# Altium schematic sheet DVC.SchDoc
size A3
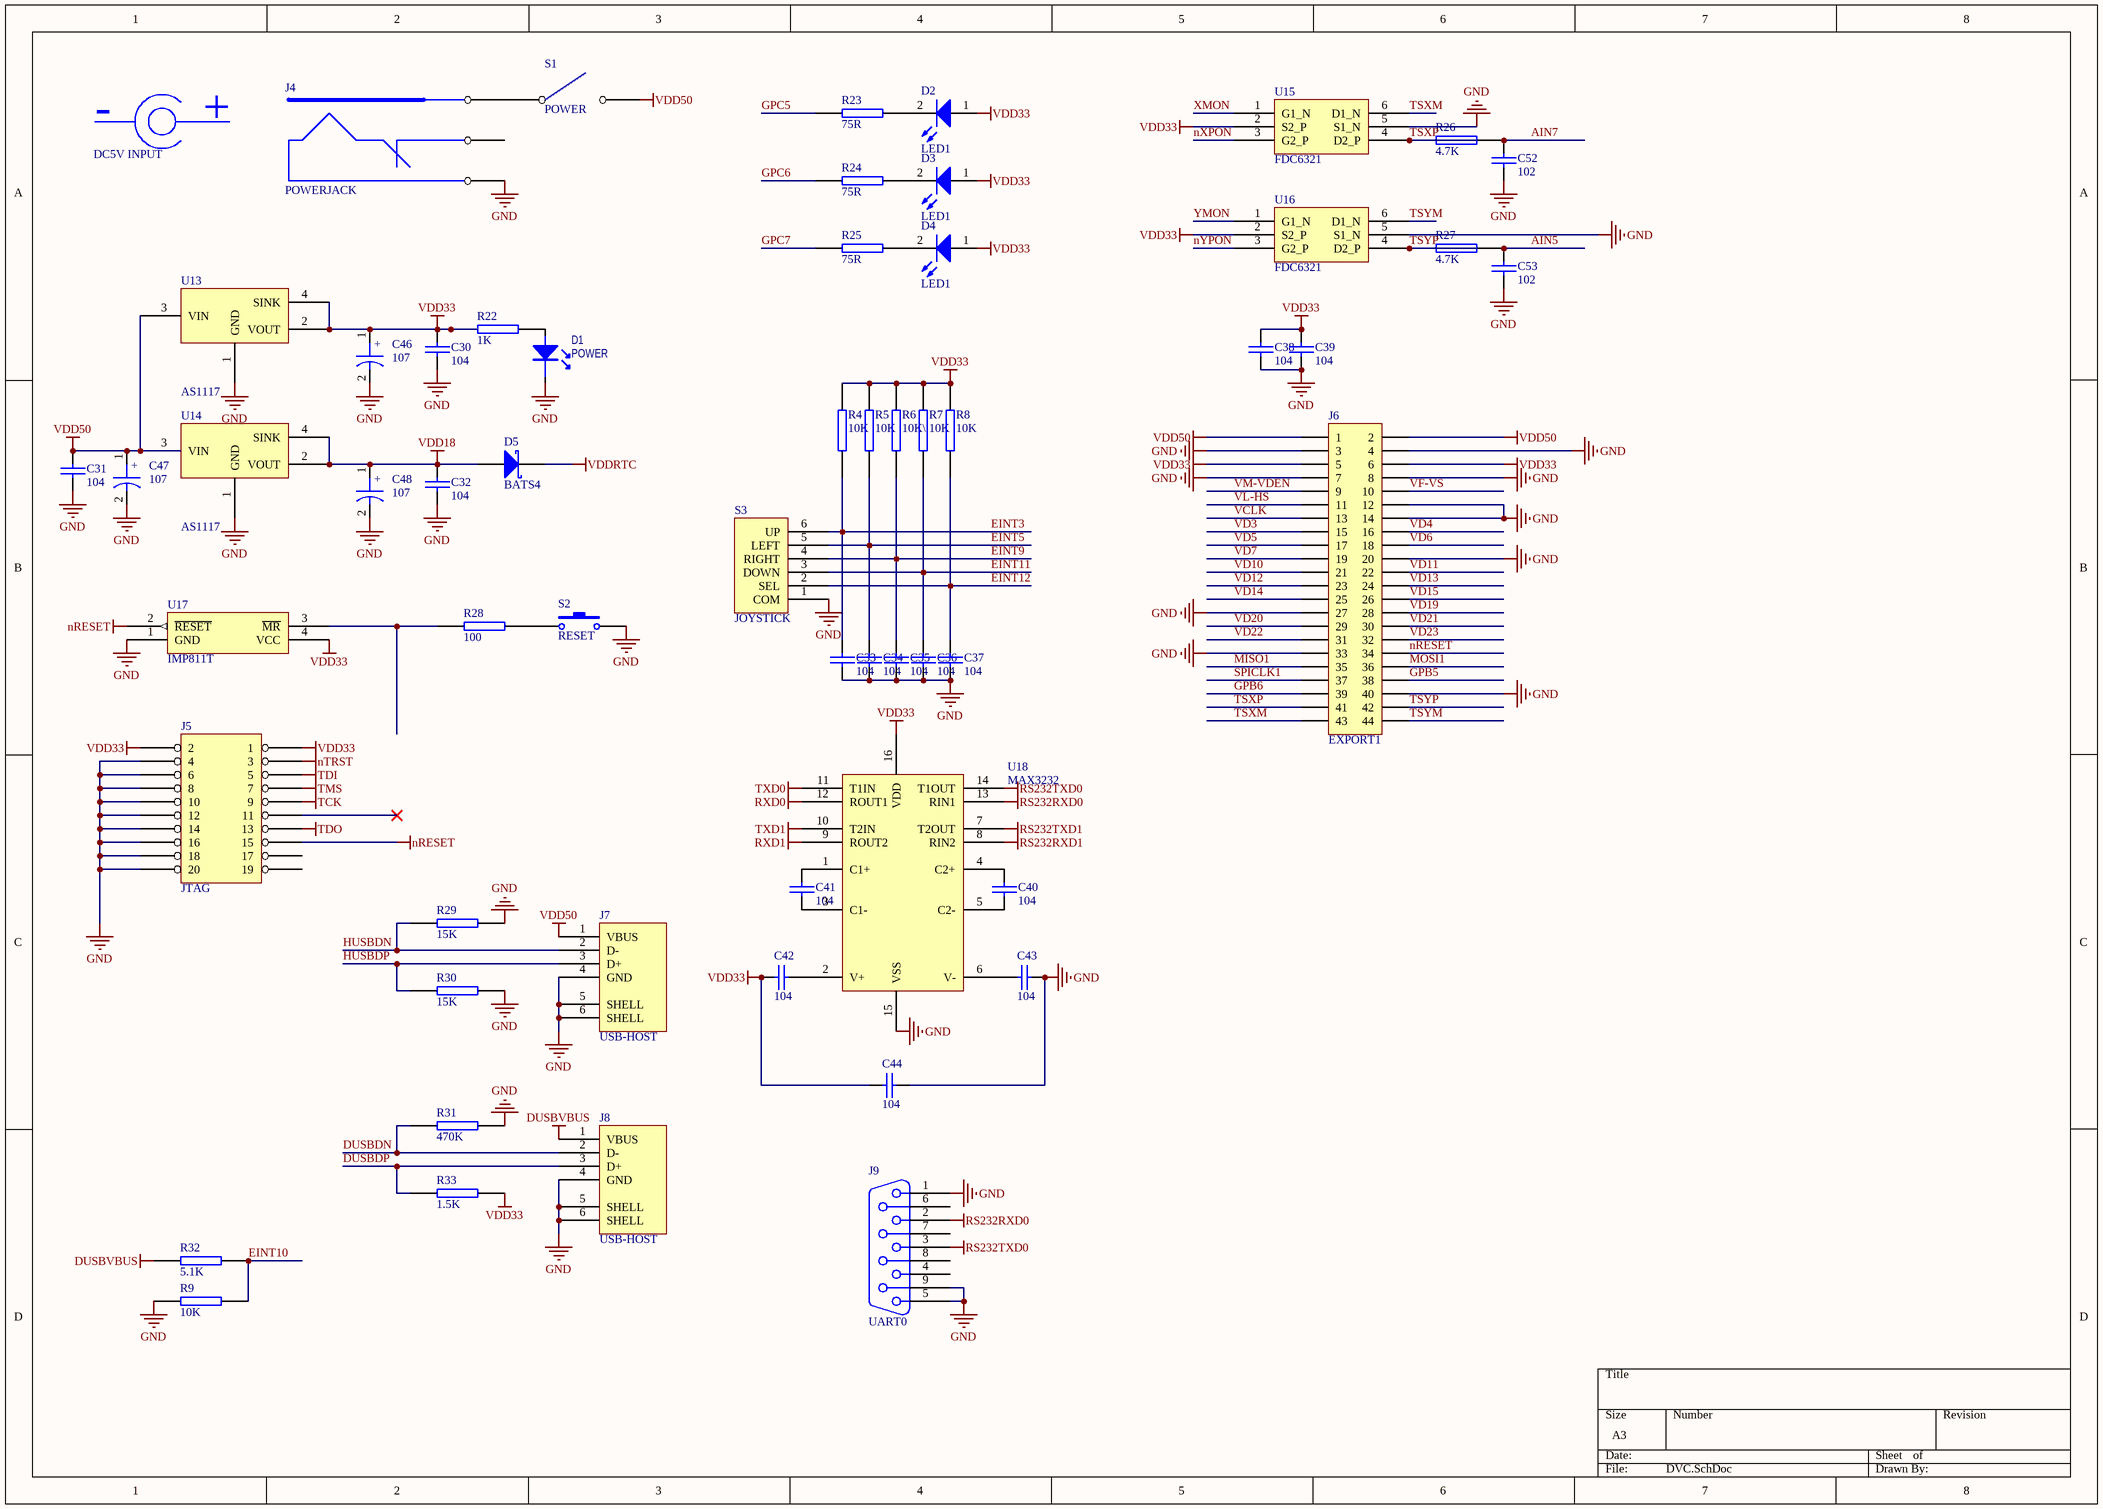
[diagram p0: DVC.SchDoc]

## Parts
?  DC5V INPUT
C30  104  [A型钽电容]
C31  104  [A型钽电容]
C32  104  [A型钽电容]
C33  104  [A型钽电容]
C34  104  [A型钽电容]
C35  104  [A型钽电容]
C36  104  [A型钽电容]
C37  104  [A型钽电容]
C38  104  [0603A]
C39  104  [0603A]
C40  104  [A型钽电容]
C41  104  [A型钽电容]
C42  104  [A型钽电容]
C43  104  [A型钽电容]
C44  104  [A型钽电容]
C46  107  [3216A]
C47  107  [3216A]
C48  107  [3216A]
C52  102  [0603A]
C53  102  [0603A]
D1  POWER  [LED]
D2  LED1  [LED0603]
D3  LED1  [LED0603]
D4  LED1  [LED0603]
D5  BATS4  [SFM-T2(3)/X1.7V]
J4  POWERJACK
J5  JTAG
J6  EXPORT1  [HDR2X22]
J7  USB-HOST
J8  USB-HOST
J9  UART0  [DB9RA/M]
R4  10K  [1206]
R5  10K  [1206]
R6  10K\  [1206]
R7  10K  [1206]
R8  10K  [1206]
R9  10K  [1206]
R22  1K  [1206]
R23  75R  [1206]
R24  75R  [1206]
R25  75R  [1206]
R26  4.7K  [1206]
R27  4.7K  [1206]
R28  100  [1206]
R29  15K  [1206]
R30  15K  [1206]
R31  470K  [1206]
R32  5.1K  [1206]
R33  1.5K  [1206]
S1  POWER
S2  RESET  [SPST-2]
S3  JOYSTICK
U13  AS1117
U14  AS1117
U15  FDC6321
U16  FDC6321
U17  IMP811T
U18  MAX3232  [SSOP16]

## Nets
DUSBVBUS: J8.1(VBUS) R32.1
GND: C30.2 C31.2 C32.2 C33.2 C34.2 C35.2 C36.2 C37.2 C38.2 C39.2 C43.1 C44.2 C46.2 C47.2 C48.2 C52.2 C53.2 D1.2 J4.3 J5.?2(4) J5.?3(6) J5.?4(8) J5.?5(10) J5.?6(12) J5.?7(14) J5.?8(16) J5.?9(18) J5.?10(20) J6.3 J6.4 J6.7 J6.8 J6.12 J6.14 J6.20 J6.27 J6.33 J6.40 J7.4(GND) J7.5(SHELL) J7.6(SHELL) J8.4(GND) J8.5(SHELL) J8.6(SHELL) J9.1 J9.5 J9.9 R9.1 R29.2 R30.2 R31.2 S2.2 S3.1(COM) U13.1(GND) U14.1(GND) U15.5(S1_N) U16.5(S1_N) U17.1(GND) U18.15(VSS)
nRESET: J5.?13(15) J6.34 U17.2(~{RESET})
nTRST: J5.?19(3)
RS232RXD0: J9.2 U18.13(RIN1)
RS232RXD1: U18.8(RIN2)
RS232TXD0: J9.3 U18.14(T1OUT)
RS232TXD1: U18.7(T2OUT)
RXD0: U18.12(ROUT1)
RXD1: U18.9(ROUT2)
TCK: J5.?16(9)
TDI: J5.?18(5)
TDO: J5.?14(13)
TMS: J5.?17(7)
TXD0: U18.11(T1IN)
TXD1: U18.10(T2IN)
VDD18: C32.1 C48.1 D5.3(A) U14.2(VOUT) U14.4(SINK)
VDD33: C30.1 C38.1 C39.1 C42.1 C44.1 C46.1 D2.1(A) D3.1(A) D4.1(A) J5.?1(2) J5.?20(1) J6.5 J6.6 R4.2 R5.2 R6.2 R7.2 R8.2 R22.1 R33.2 U13.2(VOUT) U13.4(SINK) U15.2(S2_P) U16.2(S2_P) U17.4(VCC) U18.16(VDD)
VDD50: C31.1 C47.1 J6.1 J6.2 J7.1(VBUS) S1.45 U13.3(VIN) U14.3(VIN)
VDDRTC: D5.1(K)
AIN5: C53.1 R27.2
AIN7: C52.1 R26.2
DUSBDN: J8.2(D-) R31.1
DUSBDP: J8.3(D+) R33.1
EINT3: C33.1 R4.1 S3.6(UP)
EINT5: C34.1 R5.1 S3.5(LEFT)
EINT9: C35.1 R6.1 S3.4(RIGHT)
EINT10: R9.2 R32.2
EINT11: C36.1 R7.1 S3.3(DOWN)
EINT12: C37.1 R8.1 S3.2(SEL)
GPB5: J6.38
GPB6: J6.39
GPC5: R23.1
GPC6: R24.1
GPC7: R25.1
HUSBDN: J7.2(D-) R29.1
HUSBDP: J7.3(D+) R30.1
MISO1: J6.35
MOSI1: J6.36
nXPON: U15.3(G2_P)
nYPON: U16.3(G2_P)
SPICLK1: J6.37
TSXM: J6.43 U15.6(D1_N)
TSXP: J6.41 R26.1 U15.4(D2_P)
TSYM: J6.44 U16.6(D1_N)
TSYP: J6.42 R27.1 U16.4(D2_P)
VCLK: J6.13
VD3: J6.15
VD4: J6.16
VD5: J6.17
VD6: J6.18
VD7: J6.19
VD10: J6.21
VD11: J6.22
VD12: J6.23
VD13: J6.24
VD14: J6.25
VD15: J6.26
VD19: J6.28
VD20: J6.29
VD21: J6.30
VD22: J6.31
VD23: J6.32
VF-VS: J6.10
VL-HS: J6.11
VM-VDEN: J6.9
XMON: U15.1(G1_N)
YMON: U16.1(G1_N)
NetC40_1: C40.1 U18.4(C2+)
NetC40_2: C40.2 U18.5(C2-)
NetC41_1: C41.1 U18.1(C1+)
NetC41_2: C41.2 U18.3(C1-)
NetC42_2: C42.2 U18.2(V+)
NetC43_2: C43.2 U18.6(V-)
NetD1_1: D1.1 R22.2
NetD2_2: D2.2(K) R23.2
NetD3_2: D3.2(K) R24.2
NetD4_2: D4.2(K) R25.2
NetJ4_1: J4.1 S1.44
NetR28_1: R28.1 U17.3(~{MR})
NetR28_2: R28.2 S2.1

Not connected (* = marked no-connect by the designer): J4 2; J5 ?11(19) ?12(17) ?15(11)*; J9 4 6 7 8

## Notes on the sheet
- (in symbol CAPACITOR POL_0) +
- (in symbol DC5V INPUT) -; +

## Library data of the parts
C30-C37 C40-C44 = CAP_1: Capacitor
C38 C39 C52 C53 = CAP_2: Capacitor
C46-C48 = CAPACITOR POL_0: Text Field1: 20; Text Field2: 20
D1 = LED
D2-D4 = LED0: Typical INFRARED GaAs LED; Published: 8-Jun-2000; LatestRevisionDate: 08-Jul-2005; LatestRevisionNote: Mech Layer 1 removed.; PackageReference: LED1; Publisher: Altium Limited
D5 = Diode 10TQ035: Schottky Rectifier; Note: Terminal 2 is the TAB and is electrically connected to the cathode; Published: 8-Jun-2000; LatestRevisionDate: 17-Jul-2002; LatestRevisionNote: Re-released for DXP Platform.; DatasheetVersion: PD-2.057B; PackageVersion: Feb-1998; PackageReference: TO-220AC; Publisher: Altium Limited; ComponentLink1Description: Manufacturer Link; ComponentLink1URL: http://www.irf.com/; ComponentLink2Description: Datasheet; ComponentLink2URL: http://www.irf.com/product-info/datasheets/data/10tq.pdf
J5 = JTAG20
J6 = Header 22X2: Header, 22-Pin, Dual row; LatestRevisionDate: 17-Jul-2002; LatestRevisionNote: Re-released for DXP Platform.; Publisher: Altium Limited
J7 J8 = USB
J9 = CONNECTOR DB9: Text Field1: 30; Text Field2: 100
R4-R9 R22-R33 = RES2_2
S2 = SW-PB: Switch; Published: 24-Mar-1999; LatestRevisionDate: 17-Jul-2002; LatestRevisionNote: Re-released for DXP Platform.; PackageReference: SPST-2; Publisher: Altium Limited
U17 = IMP811
U18 = MAX232SOP